# Altium project SmartIMU_I2C.PrjPCB
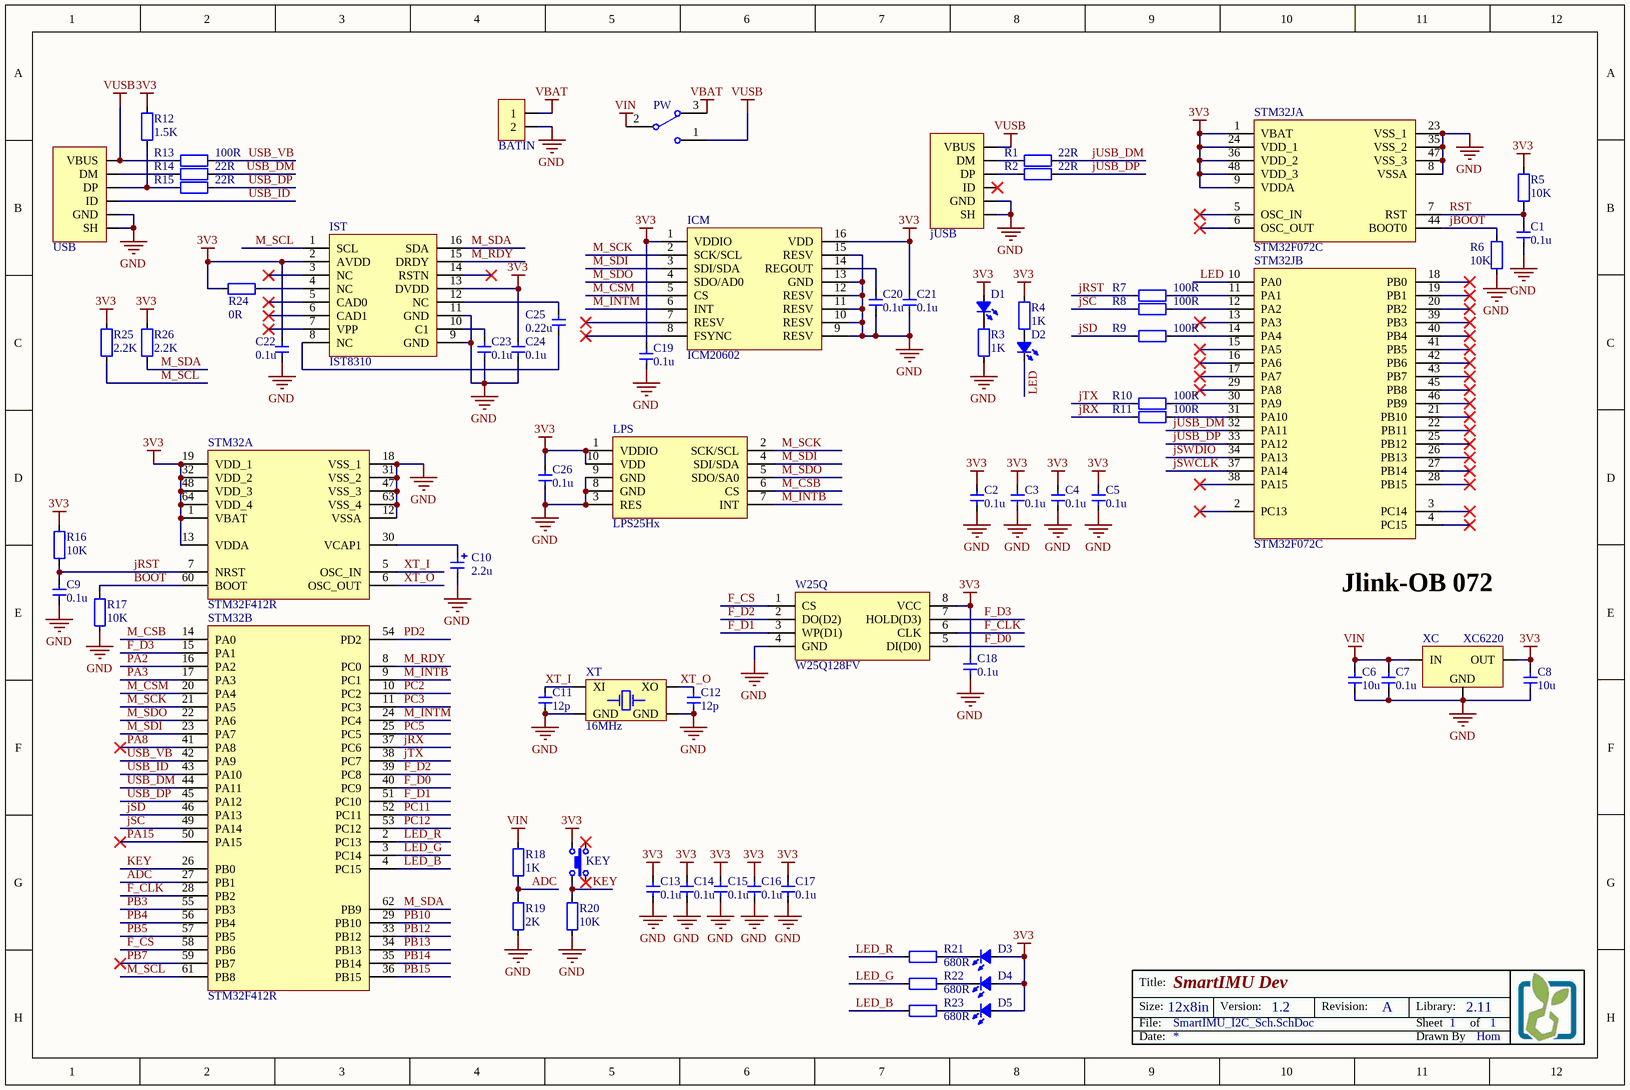
[diagram p0: SmartIMU_I2C_Sch.SchDoc]
1 sheet, 70 parts. Net scope: global (net labels, ports and power ports of the same name join across sheets).
Board file: SmartIMU_I2C_Pcb.PcbDoc

## Sheet SmartIMU_I2C_Sch.SchDoc: SmartIMU Dev
size 304 x 203 mm; Author: Hom; CompanyName: KitSprout; DrawnBy: Hom; Engineer: Hom; Organization: KitSprout; Revision: A; SheetNumber: 1; SheetTotal: 1; Version: 1.2; LibVersion: 2.11; PageSetup: Record=PageOptions|CenterHorizontal=True|CenterVertical=True|PrintScale=0.96|XCorrection=1.00|YCorrection=1.00|PrintKind=0|BorderSize=5000000|LeftOffset=0|BottomOffset=0|Orientation=2|PaperLength=1000|PaperWidth=1000|Scale=100|PaperSource=7|PrintQuality=-3|MediaType=1|DitherType=10|PrintScaleMode=1|PaperKind=A4|PaperIndex=9

### Parts
BATIN  MX1.25_2P  [MX1.25_S90_2P]  (value not drawn)
C1  value 0.1u  [CAP_0603]  (hidden comment: Cap_0603)
C2  value 0.1u  [CAP_0603]  (hidden comment: Cap_0603)
C3  value 0.1u  [CAP_0603]  (hidden comment: Cap_0603)
C4  value 0.1u  [CAP_0603]  (hidden comment: Cap_0603)
C5  value 0.1u  [CAP_0603]  (hidden comment: Cap_0603)
C6  value 10u  [CAP_0603]  (hidden comment: Cap_0603)
C7  value 0.1u  [CAP_0603]  (hidden comment: Cap_0603)
C8  value 10u  [CAP_0603]  (hidden comment: Cap_0603)
C9  value 0.1u  [CAP_0603]  (hidden comment: Cap_0603)
C10  value 2.2u  [CAP_TAN_P0805]  (hidden comment: Cap_Tan_0805)
C11  value 12p  [CAP_0603]  (hidden comment: Cap_0603)
C12  value 12p  [CAP_0603]  (hidden comment: Cap_0603)
C13  value 0.1u  [CAP_0603]  (hidden comment: Cap_0603)
C14  value 0.1u  [CAP_0603]  (hidden comment: Cap_0603)
C15  value 0.1u  [CAP_0603]  (hidden comment: Cap_0603)
C16  value 0.1u  [CAP_0603]  (hidden comment: Cap_0603)
C17  value 0.1u  [CAP_0603]  (hidden comment: Cap_0603)
C18  value 0.1u  [CAP_0603]  (hidden comment: Cap_0603)
C19  value 0.1u  [CAP_0603]  (hidden comment: Cap_0603)
C20  value 0.1u  [CAP_0603]  (hidden comment: Cap_0603)
C21  value 0.1u  [CAP_0603]  (hidden comment: Cap_0603)
C22  value 0.1u  [CAP_0603]  (hidden comment: Cap_0603)
C23  value 0.1u  [CAP_0603]  (hidden comment: Cap_0603)
C24  value 0.1u  [CAP_0603]  (hidden comment: Cap_0603)
C25  value 0.22u  [CAP_0603]  (hidden comment: Cap_0603)
C26  value 0.1u  [CAP_0603]  (hidden comment: Cap_0603)
D1  LED_0603  [LED_0603_YELLOW]  (value not drawn)
D2  LED_0603  [LED_0603_ORANGE]  (value not drawn)
D3  LED_0603  [LED_0603_RED]  (value not drawn)
D4  LED_0603  [LED_0603_GREEN]  (value not drawn)
D5  LED_0603  [LED_0603_BLUE]  (value not drawn)
ICM  ICM20602  [LGA_P0.5_16]
IST  IST8310  [QFN_P0.5_16]
jUSB  USB_Micro  [USB_Micro-AB]  (value not drawn)
KEY  ButtonTACT  [ButtonTACT_3.5*3.55_90]  (value not drawn)
LPS  LPS25Hx  [HCLGA-2.5x2.5_10]
PW  SwitchSPDT_2.8x6.6_90  [SwitchSPDT_2.8X6.6_90]  (value not drawn)
R1  value 22R  [RES_0603]  (hidden comment: Res_0603)
R2  value 22R  [RES_0603]  (hidden comment: Res_0603)
R3  value 1K  [RES_0603]  (hidden comment: Res_0603)
R4  value 1K  [RES_0603]  (hidden comment: Res_0603)
R5  value 10K  [RES_0603]  (hidden comment: Res_0603)
R6  value 10K  [RES_0603]  (hidden comment: Res_0603)
R7  value 100R  [RES_0603]  (hidden comment: Res_0603)
R8  value 100R  [RES_0603]  (hidden comment: Res_0603)
R9  value 100R  [RES_0603]  (hidden comment: Res_0603)
R10  value 100R  [RES_0603]  (hidden comment: Res_0603)
R11  value 100R  [RES_0603]  (hidden comment: Res_0603)
R12  value 1.5K  [RES_0603]  (hidden comment: Res_0603)
R13  value 100R  [RES_0603]  (hidden comment: Res_0603)
R14  value 22R  [RES_0603]  (hidden comment: Res_0603)
R15  value 22R  [RES_0603]  (hidden comment: Res_0603)
R16  value 10K  [RES_0603]  (hidden comment: Res_0603)
R17  value 10K  [RES_0603]  (hidden comment: Res_0603)
R18  value 1K  [RES_0603]  (hidden comment: Res_0603)
R19  value 2K  [RES_0603]  (hidden comment: Res_0603)
R20  value 10K  [RES_0603]  (hidden comment: Res_0603)
R21  value 680R  [RES_0603]  (hidden comment: Res_0603)
R22  value 680R  [RES_0603]  (hidden comment: Res_0603)
R23  value 680R  [RES_0603]  (hidden comment: Res_0603)
R24  value 0R  [RES_0603]  (hidden comment: Res_0603)
R25  value 2.2K  [RES_0603]  (hidden comment: Res_0603)
R26  value 2.2K  [RES_0603]  (hidden comment: Res_0603)
STM32  STM32F412R  [LQFP_P0.5_64]  (parts A,B of 2)
STM32J  STM32F072C  [LQFP_P0.5_48]  (parts A,B of 2)
USB  USB_Micro  [USB_Micro-AB]  (value not drawn)
W25Q  W25Q128FV  [SON_P1.27H_8]
XC  XC6220  [SOT89-3]
XT  value 16MHz  [XT_2520_4]  (hidden comment: XTAL_2520_4P)

### Nets
3V3: C2.2 C3.2 C4.2 C5.2 C8.2 C13.1 C14.1 C15.1 C16.1 C17.2 C18.1 C19.1 C21.1 C22.1 C24.1 C26.1 D1.1(A) D3.1(A) D4.1(A) D5.1(A) ICM.1(VDDIO) ICM.16(VDD) IST.2(AVDD) IST.13(DVDD) KEY.2 LPS.1(VDDIO) LPS.10(VDD) R4.2 R5.2 R12.1 R16.2 R24.2 R25.1 R26.1 STM32.1(VBAT) STM32.13(VDDA) STM32.19(VDD_1) STM32.32(VDD_2) STM32.48(VDD_3) STM32.64(VDD_4) STM32J.1(VBAT) STM32J.9(VDDA) STM32J.24(VDD_1) STM32J.36(VDD_2) STM32J.48(VDD_3) W25Q.8(VCC) XC.2(OUT)
GND: BATIN.2 C1.1 C2.1 C3.1 C4.1 C5.1 C6.1 C7.1 C8.1 C9.1 C10.2 C11.2 C12.2 C13.2 C14.2 C15.2 C16.2 C17.1 C18.2 C19.2 C20.2 C21.2 C22.2 C23.2 C24.2 C26.2 ICM.9(RESV) ICM.10(RESV) ICM.11(RESV) ICM.12(RESV) ICM.13(GND) ICM.15(RESV) IST.9(GND) IST.11(GND) jUSB.0(SH) jUSB.5(GND) LPS.3(RES) LPS.8(GND) LPS.9(GND) R3.1 R6.1 R17.1 R19.2 R20.1 STM32.12(VSSA) STM32.18(VSS_1) STM32.31(VSS_2) STM32.47(VSS_3) STM32.63(VSS_4) STM32J.8(VSSA) STM32J.23(VSS_1) STM32J.35(VSS_2) STM32J.47(VSS_3) USB.0(SH) USB.5(GND) W25Q.4(GND) XC.1(GND) XT.2(GND) XT.4(GND)
VBAT: BATIN.1 PW.3
VIN: C6.2 C7.2 PW.2 R18.1 XC.3(IN)
VUSB: jUSB.1(VBUS) PW.1 R13.2 USB.1(VBUS)
ADC: R18.2 R19.1 STM32.27(PB1)
BOOT: R17.2 STM32.60(BOOT)
F_CLK: STM32.28(PB2) W25Q.6(CLK)
F_CS: STM32.58(PB6) W25Q.1(CS)
F_D0: STM32.40(PC9) W25Q.5(DI(D0))
F_D1: STM32.51(PC10) W25Q.3(WP(D1))
F_D2: STM32.39(PC8) W25Q.2(DO(D2))
F_D3: STM32.15(PA1) W25Q.7(HOLD(D3))
jBOOT: R6.2 STM32J.44(BOOT0)
jRST: C9.2 R7.1 R16.1 STM32.7(NRST)
jRX: R11.1 STM32.37(PC6)
jSC: R8.1 STM32.49(PA14)
jSD: R9.1 STM32.46(PA13)
jSWCLK: STM32J.37(PA14)
jSWDIO: STM32J.34(PA13)
jTX: R10.1 STM32.38(PC7)
jUSB_DM: R1.2 STM32J.32(PA11)
jUSB_DP: R2.2 STM32J.33(PA12)
KEY: KEY.1 R20.2 STM32.26(PB0)
LED: D2.2(K) STM32J.10(PA0)
LED_B: R23.2 STM32.4(PC15)
LED_G: R22.2 STM32.3(PC14)
LED_R: R21.2 STM32.2(PC13)
M_CSB: LPS.6(CS) STM32.14(PA0)
M_CSM: ICM.5(CS) STM32.20(PA4)
M_INTB: LPS.7(INT) STM32.9(PC1)
M_INTM: ICM.6(INT) STM32.24(PC4)
M_RDY: IST.15(DRDY) STM32.8(PC0)
M_SCK: ICM.2(SCK/SCL) LPS.2(SCK/SCL) STM32.21(PA5)
M_SCL: IST.1(SCL) R25.2 STM32.61(PB8)
M_SDA: IST.16(SDA) R26.2 STM32.62(PB9)
M_SDI: ICM.3(SDI/SDA) LPS.4(SDI/SDA) STM32.23(PA7)
M_SDO: ICM.4(SDO/AD0) LPS.5(SDO/SA0) STM32.22(PA6)
PA2: STM32.16(PA2)
PA3: STM32.17(PA3)
PA8: STM32.41(PA8)
PA15: STM32.50(PA15)
PB3: STM32.55(PB3)
PB4: STM32.56(PB4)
PB5: STM32.57(PB5)
PB7: STM32.59(PB7)
PB10: STM32.29(PB10)
PB12: STM32.33(PB12)
PB13: STM32.34(PB13)
PB14: STM32.35(PB14)
PB15: STM32.36(PB15)
PC2: STM32.10(PC2)
PC3: STM32.11(PC3)
PC5: STM32.25(PC5)
PC11: STM32.52(PC11)
PC12: STM32.53(PC12)
PD2: STM32.54(PD2)
RST: C1.2 R5.1 STM32J.7(RST)
USB_DM: R14.1 STM32.44(PA11)
USB_DP: R15.1 STM32.45(PA12)
USB_ID: STM32.43(PA10) USB.4(ID)
USB_VB: R13.1 STM32.42(PA9)
XT_I: C11.1 STM32.5(OSC_IN) XT.1(XI)
XT_O: C12.1 STM32.6(OSC_OUT) XT.3(XO)
NetC10_1: C10.1 STM32.30(VCAP1)
NetC20_1: C20.1 ICM.14(REGOUT)
NetC23_1: C23.1 IST.10(C1)
NetC25_1: C25.1 IST.12(NC)
NetC25_2: C25.2 IST.8(NC)
NetD1_2: D1.2(K) R3.2
NetD2_1: D2.1(A) R4.1
NetD3_2: D3.2(K) R21.1
NetD4_2: D4.2(K) R22.1
NetD5_2: D5.2(K) R23.1
NetIST_4: IST.4(NC) R24.1
NetjUSB_2: jUSB.2(DM) R1.1
NetjUSB_3: jUSB.3(DP) R2.1
NetR7_2: R7.2 STM32J.11(PA1)
NetR8_2: R8.2 STM32J.12(PA2)
NetR9_2: R9.2 STM32J.14(PA4)
NetR10_2: R10.2 STM32J.30(PA9)
NetR11_2: R11.2 STM32J.31(PA10)
NetR12_2: R12.2 R15.2 USB.3(DP)
NetR14_2: R14.2 USB.2(DM)

Not connected (* = marked no-connect by the designer): ICM 7(RESV)* 8(FSYNC)*; IST 3(NC)* 5(CAD0)* 6(CAD1)* 7(VPP)* 14(RSTN)*; jUSB 4(ID)*; KEY 3* 4*; STM32J 2(PC13)* 3(PC14)* 4(PC15)* 5(OSC_IN)* 6(OSC_OUT)* 13(PA3)* 15(PA5)* 16(PA6)* 17(PA7)* 18(PB0)* 19(PB1)* 20(PB2)* 21(PB10)* 22(PB11)* 25(PB12)* 26(PB13)* 27(PB14)* 28(PB15)* 29(PA8)* 38(PA15)* 39(PB3)* 40(PB4)* 41(PB5)* 42(PB6)* 43(PB7)* 45(PB8)* 46(PB9)*

### Notes on the sheet
- Jlink-OB 072
- Title:
- Size:
- Date:
- File:
- 12x8in
- Version:
- Revision:
- Sheet
- Drawn By
- Library:
- of

### Library data of the parts
BATIN = MX1.25_2P: MX
C1-C9 C11-C26 = Cap_0603: Capacitor
C10 = Cap_Tan_0805: Capacitor
D1-D5 = LED_0603: LED
ICM = ICM20602: Sensor Motion
IST = IST8310: Sensor Magnetometer
jUSB USB = USB_Micro: USB
KEY = ButtonTACT: Button
LPS = LPS25Hx: Sensor Pressure
PW = SwitchSPDT_2.8x6.6_90: Switch
R1-R26 = Res_0603: Resistor
STM32 = STM32F412R/446R: MCU
STM32J = STM32F103C: MCU
W25Q = W25Q_8: FLASH
XC = XC6220: Power
XT = XTAL_2520_4P: Crystal Oscillator